# Altium schematic sheet piccaloSchematic.SchDoc
size A
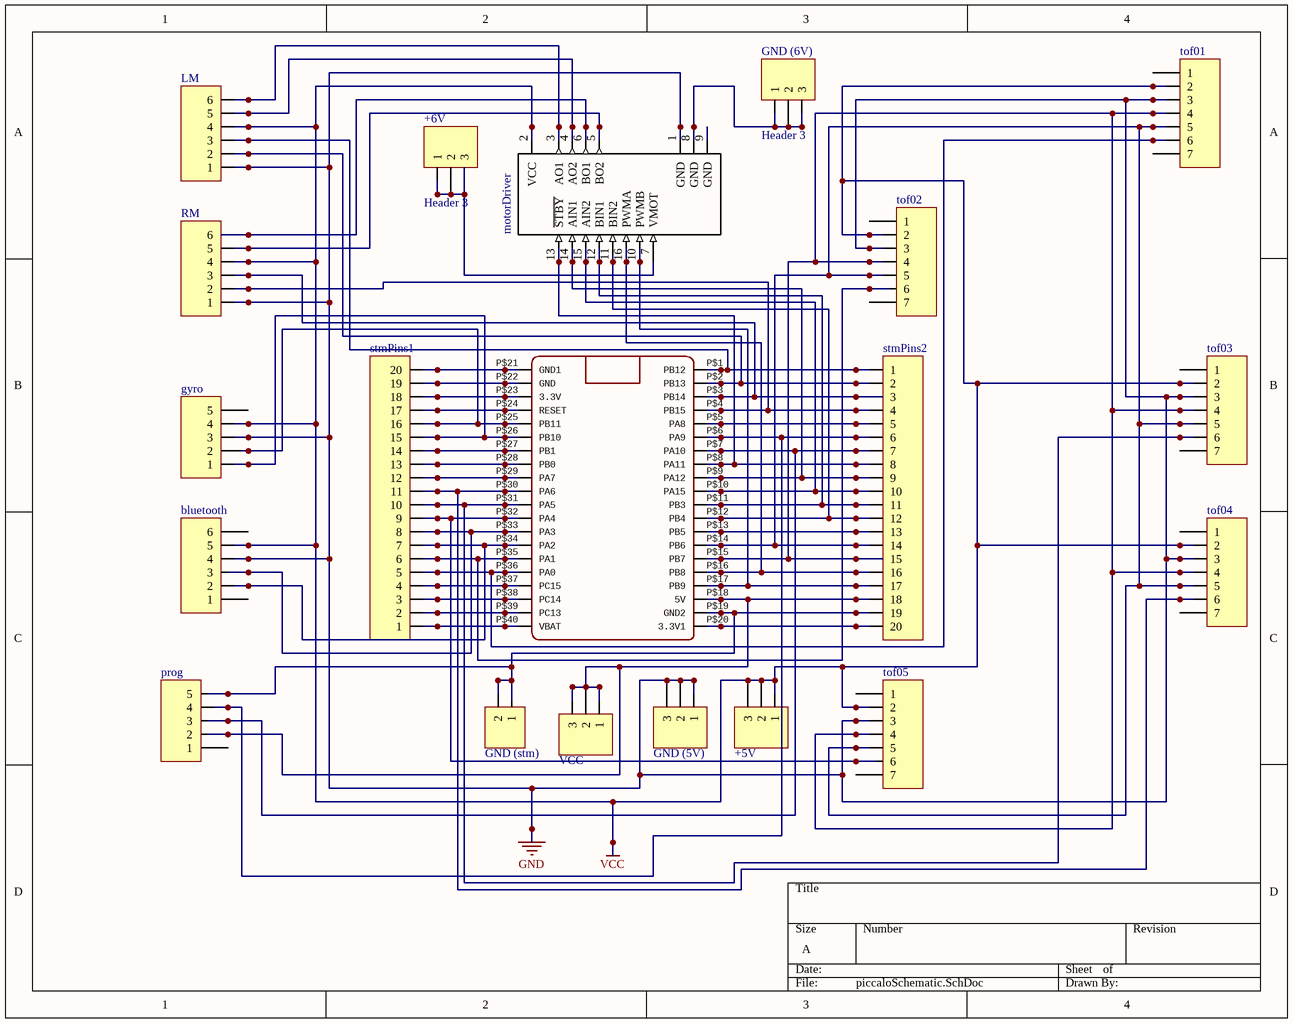
[diagram p0: piccaloSchematic.SchDoc]

## Parts
+5V  Header 3  [HDR1X3]  (value not drawn)
+6V  Header 3  [HDR1X3]
bluetooth  Header 6  [HDR1X6]  (value not drawn)
GND_(5V)  Header 3  [HDR1X3]  (value not drawn)
GND_(6V)  Header 3  [HDR1X3]
GND_(stm)  Header 2  [HDR1X2]  (value not drawn)
gyro  Header 5  [HDR1X5]  (value not drawn)
LM  Header 6  [HDR1X6]  (value not drawn)
motorDriver  POLOLU-713  [*SHIELD_POLOLU-713]  (value not drawn)
prog  Header 5  [HDR1X5]  (value not drawn)
RM  Header 6  [HDR1X6]  (value not drawn)
stm32  (no value)  [BLUE_PILL]
stmPins1  Header 20  [HDR1X20]  (value not drawn)
stmPins2  Header 20  [HDR1X20]  (value not drawn)
tof01  Header 7  [HDR1X7]  (value not drawn)
tof02  Header 7  [HDR1X7]  (value not drawn)
tof03  Header 7  [HDR1X7]  (value not drawn)
tof04  Header 7  [HDR1X7]  (value not drawn)
tof05  Header 7  [HDR1X7]  (value not drawn)
VCC  Header 3  [HDR1X3]  (value not drawn)

## Nets
GND: bluetooth.4 GND_(5V).1 GND_(5V).2 GND_(5V).3 gyro.3 LM.1 motorDriver.1(GND) RM.1 tof01.3 tof02.3 tof03.3 tof04.3 tof05.3
VCC: +5V.1 +5V.2 +5V.3 bluetooth.5 gyro.4 LM.4 motorDriver.2(VCC) RM.4 tof01.2 tof02.2 tof03.2 tof04.2 tof05.2
Net+6V_1: +6V.1 +6V.2 +6V.3 motorDriver.7(VMOT)
Netbluetooth_2: bluetooth.2 stm32.P$34(PA2) stmPins1.7
Netbluetooth_3: bluetooth.3 stm32.P$33(PA3) stmPins1.8
NetGND_(6V)_1: GND_(6V).1 GND_(6V).2 GND_(6V).3 motorDriver.8(GND)
NetGND_(stm)_1: GND_(stm).1 GND_(stm).2 prog.5 stm32.P$19(GND2) stmPins2.19
Netgyro_1: gyro.1 stm32.P$26(PB10) stmPins1.15
Netgyro_2: gyro.2 stm32.P$25(PB11) stmPins1.16
NetLM_2: LM.2 stm32.P$2(PB13) stmPins2.2
NetLM_3: LM.3 stm32.P$1(PB12) stmPins2.1
NetLM_5: LM.5 motorDriver.4(AO2)
NetLM_6: LM.6 motorDriver.3(AO1)
NetmotorDriver_5: motorDriver.5(BO2) RM.5
NetmotorDriver_6: motorDriver.6(BO1) RM.6
NetmotorDriver_10: motorDriver.10(PWMB) stm32.P$17(PB9) stmPins2.17
NetmotorDriver_11: motorDriver.11(BIN2) stm32.P$12(PB4) stmPins2.12
NetmotorDriver_12: motorDriver.12(BIN1) stm32.P$11(PB3) stmPins2.11
NetmotorDriver_13: motorDriver.13(~{STBY}) stm32.P$8(PA11) stmPins2.8
NetmotorDriver_14: motorDriver.14(AIN1) stm32.P$9(PA12) stmPins2.9
NetmotorDriver_15: motorDriver.15(AIN2) stm32.P$10(PA15) stmPins2.10
NetmotorDriver_16: motorDriver.16(PWMA) stm32.P$16(PB8) stmPins2.16
Netprog_2: prog.2 stm32.P$18(5V) stmPins2.18 VCC.1 VCC.2 VCC.3
Netprog_3: prog.3 stm32.P$7(PA10) stmPins2.7
Netprog_4: prog.4 stm32.P$6(PA9) stmPins2.6
NetRM_2: RM.2 stm32.P$4(PB15) stmPins2.4
NetRM_3: RM.3 stm32.P$3(PB14) stmPins2.3
Netstm32_P$5: stm32.P$5(PA8) stmPins2.5
Netstm32_P$13: stm32.P$13(PB5) stmPins2.13
Netstm32_P$14: stm32.P$14(PB6) stmPins2.14 tof01.5 tof02.5 tof03.5 tof04.5 tof05.5
Netstm32_P$15: stm32.P$15(PB7) stmPins2.15 tof01.4 tof02.4 tof03.4 tof04.4 tof05.4
Netstm32_P$20: stm32.P$20(3.3V1) stmPins2.20
Netstm32_P$21: stm32.P$21(GND1) stmPins1.20
Netstm32_P$22: stm32.P$22(GND) stmPins1.19
Netstm32_P$23: stm32.P$23(3.3V) stmPins1.18
Netstm32_P$24: stm32.P$24(RESET) stmPins1.17
Netstm32_P$27: stm32.P$27(PB1) stmPins1.14
Netstm32_P$28: stm32.P$28(PB0) stmPins1.13
Netstm32_P$29: stm32.P$29(PA7) stmPins1.12
Netstm32_P$30: stm32.P$30(PA6) stmPins1.11 tof04.6
Netstm32_P$31: stm32.P$31(PA5) stmPins1.10 tof03.6
Netstm32_P$32: stm32.P$32(PA4) stmPins1.9 tof05.6
Netstm32_P$35: stm32.P$35(PA1) stmPins1.6 tof02.6
Netstm32_P$36: stm32.P$36(PA0) stmPins1.5 tof01.6
Netstm32_P$37: stm32.P$37(PC15) stmPins1.4
Netstm32_P$38: stm32.P$38(PC14) stmPins1.3
Netstm32_P$39: stm32.P$39(PC13) stmPins1.2
Netstm32_P$40: stm32.P$40(VBAT) stmPins1.1

Not connected (* = marked no-connect by the designer): bluetooth 1 6; gyro 5; motorDriver 9(GND); prog 1; tof01 1 7; tof02 1 7; tof03 1 7; tof04 1 7; tof05 1 7

## Library data of the parts
+5V +6V GND_(5V) GND_(6V) VCC = Header 3: Header, 3-Pin; LatestRevisionDate: 17-Jul-2002; LatestRevisionNote: Re-released for DXP Platform.; Publisher: Altium Limited
bluetooth LM RM = Header 6: Header, 6-Pin; LatestRevisionDate: 17-Jul-2002; LatestRevisionNote: Re-released for DXP Platform.; Publisher: Altium Limited
GND_(stm) = Header 2: Header, 2-Pin; LatestRevisionDate: 17-Jul-2002; LatestRevisionNote: Re-released for DXP Platform.; Publisher: Altium Limited
gyro prog = Header 5: Header, 5-Pin; LatestRevisionDate: 17-Jul-2002; LatestRevisionNote: Re-released for DXP Platform.; Publisher: Altium Limited
motorDriver = POLOLU-713: DC-motor driver; IC: TB6612FNG; 100kHz; 1A; Uin mot: 4.5; MF: Pololu; SnapEDA_Link: https://www.snapeda.com/parts/POLOLU-713/Pololu/view-part/?ref=snap; Availability: Unavailable; Price: None; Package: None; MP: POLOLU-713; Value: *
stm32 = BLUE_PILL
stmPins1 stmPins2 = Header 20: Header, 20-Pin; LatestRevisionDate: 17-Jul-2002; LatestRevisionNote: Re-released for DXP Platform.; Publisher: Altium Limited
tof01 tof02 tof03 tof04 tof05 = Header 7: Header, 7-Pin; LatestRevisionDate: 17-Jul-2002; LatestRevisionNote: Re-released for DXP Platform.; Publisher: Altium Limited